# EAGLE design thrust_stand (EAGLE 7.6.0)
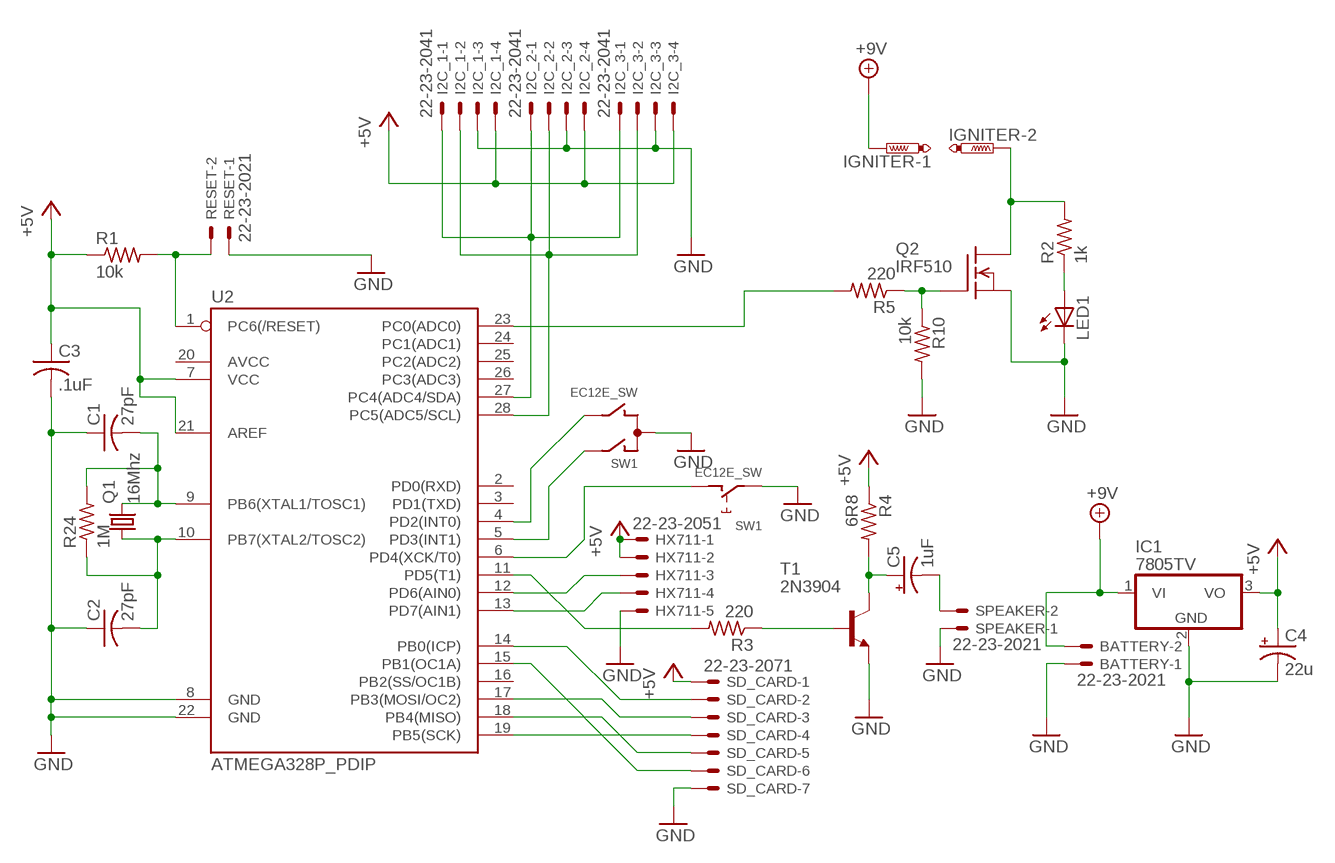
[diagram p0: schematic, sheet 1]

## Parts
BATTERY  22-23-2021  [22-23-2021]
C1  27pF  C-US025-040X050  [C025-040X050]
C2  27pF  C-US025-040X050  [C025-040X050]
C3  .1uF  C-US025-030X050  [C025-030X050]
C4  22u  CPOL-USB45181A  [B45181A]
C5  1uF  CPOL-USB45181A  [B45181A]
HX711  22-23-2051  [22-23-2051]
I2C_1  22-23-2041  [22-23-2041]
I2C_2  22-23-2041  [22-23-2041]
I2C_3  22-23-2041  [22-23-2041]
IC1  7805TV  [TO220V]
IGNITER  PTR2  [P2-38-17]
LED1  LED5MM  [LED5MM]
Q1  16Mhz  CRYSTALHC49S  [HC49/S]
Q2  IRF510  [TO220]
R1  10k  R-US_0207/7  [0207/7]
R2  1k  R-US_0207/7  [0207/7]
R3  220  R-US_0207/7  [0207/7]
R4  6R8  R-US_0207/7  [0207/7]
R5  220  R-US_0309/10  [0309/10]
R10  10k  R-US_0207/7  [0207/7]
R24  1M  R-US_0207/7  [0207/7]
RESET  22-23-2021  [22-23-2021]
SD_CARD  22-23-2071  [22-23-2071]
SPEAKER  22-23-2021  [22-23-2021]
SW1  EC12E_SW  [ALPS_EC12E_SW]
T1  2N3904  [TO92]
U2  ATMEGA328P_PDIP  [DIL28-3]

## Nets
+5V: C3.1 C4.+ HX711.1 HX711.2 I2C_1.4 I2C_2.4 I2C_3.4 IC1.3(VO) R1.1 R4.1 SD_CARD.1 U2.7(VCC) U2.21(AREF)
+9V: BATTERY.2 IC1.1(VI) IGNITER.TP-1
GND: BATTERY.1 C1.1 C2.1 C3.2 C4.- HX711.5 I2C_1.3 I2C_2.3 I2C_3.3 IC1.2(GND) LED1.K(C) Q2.3(S) R10.2 RESET.1 SD_CARD.7 SPEAKER.1 SW1.C SW1.E T1.3(E) U2.8(GND) U2.22(GND)
N$1: I2C_1.2 I2C_2.2 I2C_3.2 U2.28(PC5(ADC5/SCL))
N$2: I2C_1.1 I2C_2.1 I2C_3.1 U2.27(PC4(ADC4/SDA))
N$3: HX711.3 U2.12(PD6(AIN0))
N$4: C1.2 Q1.2 R24.2 U2.9(PB6(XTAL1/TOSC1))
N$5: C2.2 Q1.1 R24.1 U2.10(PB7(XTAL2/TOSC2))
N$6: HX711.4 U2.13(PD7(AIN1))
N$7: SD_CARD.2 U2.14(PB0(ICP))
N$8: SD_CARD.3 U2.17(PB3(MOSI/OC2))
N$9: SD_CARD.4 U2.19(PB5(SCK))
N$10: SD_CARD.5 U2.18(PB4(MISO))
N$11: SD_CARD.6 U2.15(PB1(OC1A))
N$12: Q2.1(G) R5.1 R10.1
N$13: R3.2 U2.11(PD5(T1))
N$14: R3.1 T1.2(B)
N$15: C5.+ R4.2 T1.1(C)
N$16: C5.- SPEAKER.2
N$17: IGNITER.TP-2 Q2.2(D) R2.2
N$18: R5.2 U2.23(PC0(ADC0))
N$19: SW1.B U2.4(PD2(INT0))
N$20: SW1.A U2.5(PD3(INT1))
N$21: LED1.A R2.1
N$22: SW1.D U2.6(PD4(XCK/T0))
N$43: R1.2 RESET.2 U2.1(PC6(/RESET))
Unconnected: SW1.GND1(G) SW1.GND2(G) U2.2(PD0(RXD)) U2.3(PD1(TXD)) U2.16(PB2(SS/OC1B)) U2.20(AVCC) U2.24(PC1(ADC1)) U2.25(PC2(ADC2)) U2.26(PC3(ADC3))

## Library data of the parts
BATTERY RESET SPEAKER = con-molex:22-23-2021: .100" (2.54mm) Center Header - 2 Pin; MF: MOLEX; MPN: 22-23-2021; OC_FARNELL: 1462926; OC_NEWARK: 25C3832
C1-C3 = rcl:C-US: CAPACITOR, American symbol
C4 C5 = rcl:CPOL-US: POLARIZED CAPACITOR, American symbol
HX711 = con-molex:22-23-2051: .100" (2.54mm) Center Header - 5 Pin; MF: MOLEX; MPN: 22-23-2051; OC_FARNELL: 1462952; OC_NEWARK: 38C9178
I2C_1-I2C_3 = con-molex:22-23-2041: .100" (2.54mm) Center Header - 4 Pin; MF: MOLEX; MPN: 22-23-2041; OC_FARNELL: 1462920; OC_NEWARK: 38C0355
IC1 = linear:78*: Positive VOLTAGE REGULATOR Source: http://cache.national.com/ds/LM/LM78L05.pdf http://www.fairchildsemi.com/ds/LM/LM7805.pdf
IGNITER = testpad:PTR2: TEST PIN
LED1 = led:LED: LED OSRAM: - CHIPLED LG R971, LG N971, LY N971, LG Q971, LY Q971, LO R971, LY R971 LH N974, LH R974 LS Q976, LO Q976, LY Q976 LO Q996 - Hyper CHIPLED LW Q18S LB Q993, LB Q99A, LB R99A - SideLED LS A670, LO A670, LY A670, LG A670, LP A670 LB A673, LV A673, LT A673, LW A673 LH A674 LY A675 LS A676, LA A676, LO A676, LY A676, LW A676 LS A679, LY A679, LG A679 - Hyper Micro SIDELED® LS Y876, LA Y876, LO Y876, LY Y876 LT Y87S - SmartLED LW L88C, LW L88S LB L89C, LB L89S, LG L890 LS L89K, LO L89K, LY L89K LS L896, LA L896, LO L896, LY L896 - TOPLED LS T670, LO T670, LY T670, LG T670, LP T670 LSG T670, LSP T670, LSY T670, LOP T670, LYG T670 LG T671, LOG T671, LSG T671 LB T673, LV T673, LT T673, LW T673 LH T674 LS T676, LA T676, LO T676, LY T676, LB T676, LH T676, LSB T676, LW T676 LB T67C, LV T67C, LT T67C, LS T67K, LO T67K, LY T67K, LW E67C LS E67B, LA E67B, LO E67B, LY E67B, LB E67C, LV E67C, LT E67C LW T67C LS T679, LY T679, LG T679 LS T770, LO T770, LY T770, LG T770, LP T770 LB T773, LV T773, LT T773, LW T773 LH T774 LS E675, LA E675, LY E675, LS T675 LS T776, LA T776, LO T776, LY T776, LB T776 LHGB T686 LT T68C, LB T68C - Hyper Mini TOPLED® LB M676 - Mini TOPLED Santana® LG M470 LS M47K, LO M47K, LY M47K Source: http://www.osram.convergy.de LUXEON: - LUMILED® LXK2-PW12-R00, LXK2-PW12-S00, LXK2-PW14-U00, LXK2-PW14-V00 LXK2-PM12-R00, LXK2-PM12-S00, LXK2-PM14-U00 LXK2-PE12-Q00, LXK2-PE12-R00, LXK2-PE12-S00, LXK2-PE14-T00, LXK2-PE14-U00 LXK2-PB12-K00, LXK2-PB12-L00, LXK2-PB12-M00, LXK2-PB14-N00, LXK2-PB14-P00, LXK2-PB14-Q00 LXK2-PR12-L00, LXK2-PR12-M00, LXK2-PR14-Q00, LXK2-PR14-R00 LXK2-PD12-Q00, LXK2-PD12-R00, LXK2-PD12-S00 LXK2-PH12-R00, LXK2-PH12-S00 LXK2-PL12-P00, LXK2-PL12-Q00, LXK2-PL12-R00 Source: www.luxeon.com KINGBRIGHT: KA-3528ASYC Source: www.kingbright.com
Q1 = crystal:CRYSTAL: CRYSTAL; OC_FARNELL: 1667008; OC_NEWARK: unknown
Q2 = transistor-fet:IRF510: N-Channel Enhancement MOSFET (HEXFET); 100V; 5,6A; 0,54Ohm
R1-R5 R10 R24 = rcl:R-US_: RESISTOR, American symbol
SD_CARD = con-molex:22-23-2071: .100" (2.54mm) Center Header - 7 Pin; MF: MOLEX; MPN: 22-23-2071; OC_FARNELL: 1654534; OC_NEWARK: 56H0445
SW1 = switch-alps:EC12E_SW: ALPS rotary Encoder EC12E series with switch; MPN: EC12E2424407; OC_FARNELL: 1520813; OC_NEWARK: 74M1068
T1 = transistor:2N3904: NPN TRANSISTOR
U2 = SparkFun-DigitalIC:ATMEGA328P_PDIP: uC used in the Arduino 32kb flash, 1k EEPROM, 2k SRAM This is the through-hole version of this chip.

## Net classes
1 GND: width 1.016 mm, drill 1.016 mm, clearance 0.508 mm

## Board
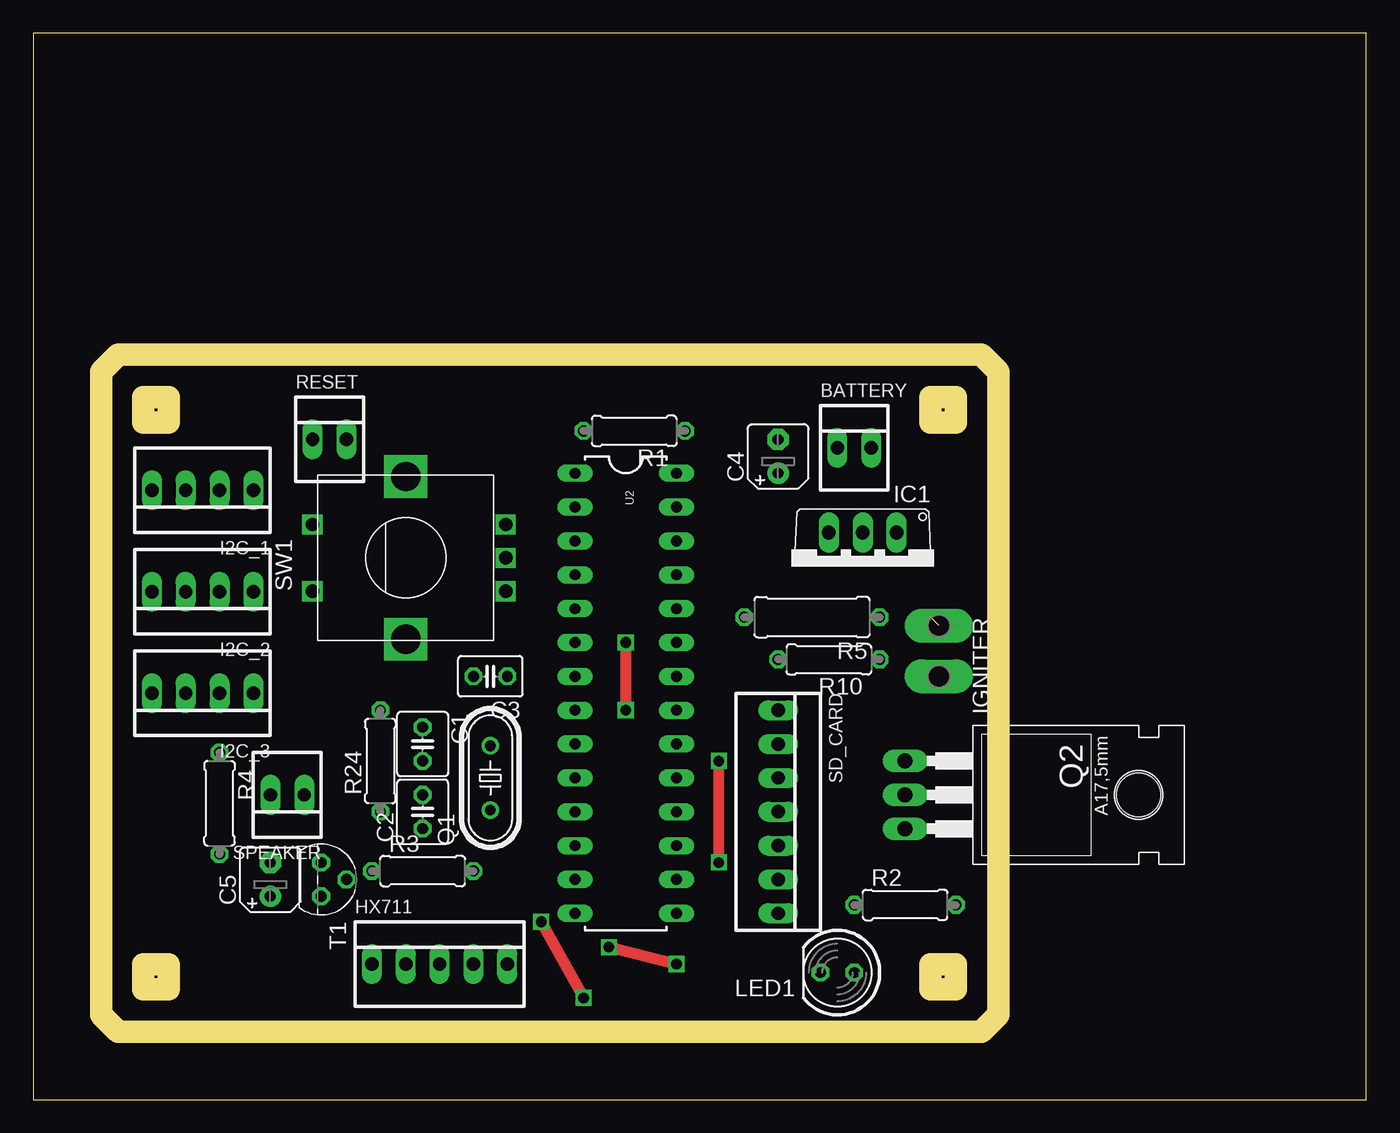
[diagram p1: board, top side]
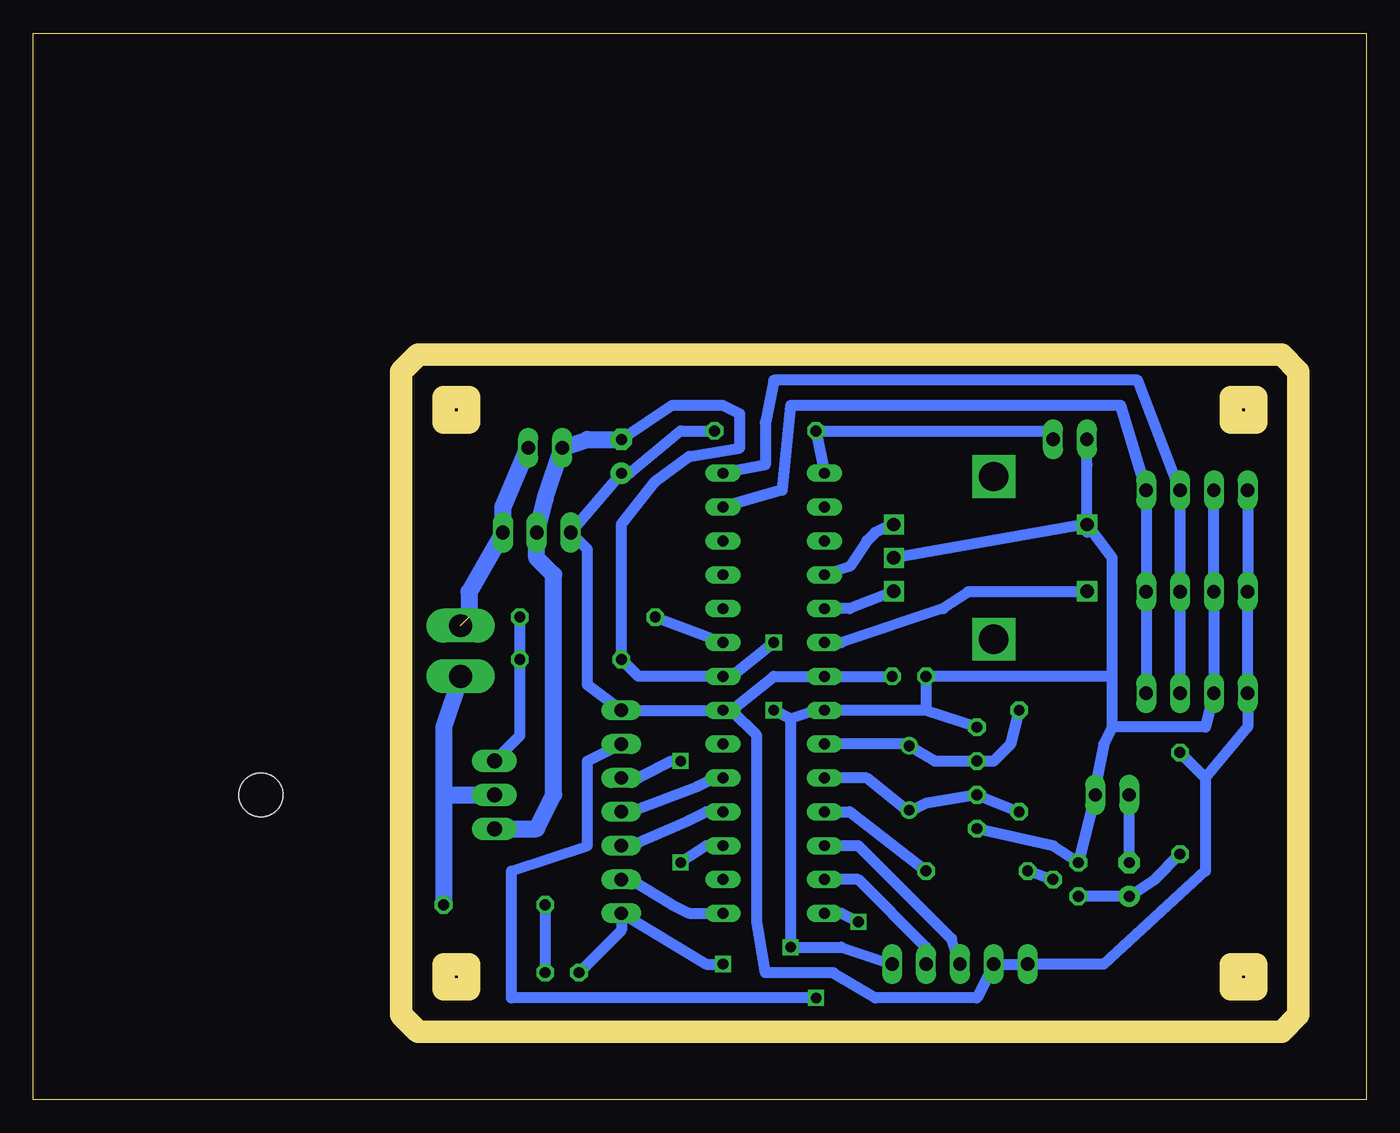
[diagram p2: board, bottom side, seen from below]

Size 100 x 80 mm. Coordinates in mm from the lower left corner, seen from the top.
Outline: 0,0 100,0 100,80 0,80 0,0
Copper layers (1*16): Top 0.035mm / dielectric 1.5mm / Bottom 0.035mm
Design rules "default *": minimum track width 32mil, minimum drill 31mil, track to track 18mil, track to pad 18mil, pad to pad 18mil, via to via 18mil, smd to smd 8mil, copper to edge 0mil, drill to drill 18mil, minimum pad ring 10mil, minimum via ring 8mil, stop-mask expansion 4mil, vias tented up to drill 0mil, thermal gap 10mil
Milling: 24 lines

### Footprints (pad centres in the part's own frame; a part is rotated, then mirrored left to right if it is on the bottom)
22-23-2021 = drill 1 long: 1 -1.27,0; 2 1.27,0
C025-040X050 = drill 0.813 octagon: 1 -1.27,0; 2 1.27,0
C025-030X050 = drill 0.813 octagon: 1 -1.27,0; 2 1.27,0
B45181A = drill 0.813 pad 1.6: + -1.27,0 | drill 0.813 pad 1.6 octagon: - 1.27,0
22-23-2051 = drill 1 long: 1 -5.08,0; 2 -2.54,0; 3 0,0; 4 2.54,0; 5 5.08,0
22-23-2041 = drill 1 long: 1 -3.81,0; 2 -1.27,0; 3 1.27,0; 4 3.81,0
TO220V = drill 1.016 long: 1 -2.54,-2.54; 2 0,-2.54; 3 2.54,-2.54
P2-38-17 = drill 1.702 pad 2.121 long: TP-1 -1.905,0; TP-2 1.905,0
LED5MM = drill 0.813 octagon: A -1.27,0; K 1.27,0
HC49/S = drill 0.813: 1 -2.413,0; 2 2.413,0
TO220 = drill 1.118 long: 1 -2.54,-6.35; 2 0,-6.35; 3 2.54,-6.35 | hole 3.302: 0,11.176
0207/7 = drill 0.813 octagon: 1 -3.81,0; 2 3.81,0
0309/10 = drill 0.813 octagon: 1 -5.08,0; 2 5.08,0
22-23-2071 = drill 1 long: 1 -7.62,0; 2 -5.08,0; 3 -2.54,0; 4 0,0; 5 2.54,0; 6 5.08,0; 7 7.62,0
ALPS_EC12E_SW = drill 1 square: A -2.5,-7.5; B 2.5,-7.5; C 0,-7.5; D -2.5,7; E 2.5,7 | drill 2.2 square: GND1 -6.1,0; GND2 6.1,0
TO92 = drill 0.813 octagon: 1 1.27,0; 2 0,1.905; 3 -1.27,0
DIL28-3 = drill 0.813 long: 1 -16.51,-3.81; 2 -13.97,-3.81; 3 -11.43,-3.81; 4 -8.89,-3.81; 5 -6.35,-3.81; 6 -3.81,-3.81; 7 -1.27,-3.81; 8 1.27,-3.81; 9 3.81,-3.81; 10 6.35,-3.81; 11 8.89,-3.81; 12 11.43,-3.81; 13 13.97,-3.81; 14 16.51,-3.81; 15 16.51,3.81; 16 13.97,3.81; 17 11.43,3.81; 18 8.89,3.81; 19 6.35,3.81; 20 3.81,3.81; 21 1.27,3.81; 22 -1.27,3.81; 23 -3.81,3.81; 24 -6.35,3.81; 25 -8.89,3.81; 26 -11.43,3.81; 27 -13.97,3.81; 28 -16.51,3.81

### Placement (x,y rotation side)
BATTERY  61.59,48.9 0 top
C1  29.21,26.67 270 top
C2  29.21,21.59 90 top
C3  34.29,31.75 180 top
C4  55.88,48.26 90 top
C5  17.78,16.51 90 top
HX711  30.48,10.16 0 top
I2C_1  12.7,45.72 180 top
I2C_2  12.7,38.1 180 top
I2C_3  12.7,30.48 180 top
IC1  62.23,40.01 180 top
IGNITER  67.94,33.66 270 top
LED1  60.33,9.53 180 top
Q1  34.29,24.13 90 top
Q2  71.75,22.86 270 top
R1  45.09,50.16 180 top
R2  65.41,14.61 0 top
R3  29.21,17.14 0 top
R4  13.97,22.23 270 top
R5  58.42,36.2 180 top
R10  59.69,33.02 180 top
R24  26.04,25.4 90 top
RESET  22.23,49.53 0 top
SD_CARD  55.88,21.59 270 top
SPEAKER  19.05,22.86 180 top
SW1  27.94,40.64 90 top
T1  21.59,16.51 270 top
U2  44.45,30.48 270 top

### Tracks (layer width: path | path; a pad name or v marks a point on that pad's centre or on a via)
+5V
  Bottom 0.813: R1.1 51.44,50.16 55.24,46.99 C4.+ IC1.3 58.42,41.27 58.42,31.11 SD_CARD.1 U2.21 47.62,29.21 | C3.1 U2.7 44.45,31.75 47.62,29.21 | I2C_1.4 I2C_2.4 I2C_3.4 8.89,27.94 12.06,24.13 | 12.06,24.13 R4.1 | 12.06,24.13 12.06,17.14 19.68,10.16 HX711.1 HX711.2 29.21,7.62 36.83,7.62 40.01,9.53 45.09,9.53 45.72,13.34 45.72,27.3 47.62,29.21
+9V  (1 unrouted)
  Bottom 1.27: BATTERY.2 64.77,44.45 IC1.1 67.31,38.1 67.31,36.2
GND  (via drill 0.8)
  Top 0.813: v48.26,10.16 v43.18,11.43 | v44.45,29.21 v44.45,34.29
  Bottom 0.813: 20.95,43.18 SW1.C | 20.95,43.18 20.95,42.55 SW1.E 20.94,47.61 RESET.1 | 33.02,29.21 C3.2 19.05,31.75 | 33.02,29.21 C1.1 | 33.02,29.21 U2.8 41.27,29.21 43.18,28.57 | HX711.5 39.37,11.43 v43.18,11.43 43.18,28.57 | C2.1 23.5,19.05 T1.3 SPEAKER.1 20.32,23.5 19.68,26.67 19.05,27.94 | I2C_1.3 I2C_2.3 I2C_3.3 12.06,27.94 19.05,27.94 | 20.95,43.18 19.05,40.64 19.05,31.75 | 19.05,27.94 19.05,31.75 | v48.26,10.16 49.53,10.16 SD_CARD.7 55.88,12.7 LED1.K | 43.18,28.57 v44.45,29.21 | v44.45,34.29 47.62,31.75 U2.22 54.61,31.75 R10.2 55.88,43.18 53.34,46.35 50.8,48.26 46.99,48.9 46.99,51.44 48.26,52.07 52.07,52.07 C4.-
  Bottom 1.27: C4.- 58.42,49.53 BATTERY.1 61.59,45.09 IC1.2 62.23,40.64 60.96,39.37 60.96,22.86 62.23,20.32 Q2.3
N$1
  Bottom 0.813: I2C_3.2 I2C_2.2 I2C_1.2 17.14,53.98 44.45,53.98 45.09,50.8 45.09,47.62 U2.28
N$2
  Bottom 0.813: I2C_3.1 I2C_2.1 I2C_1.1 18.41,52.07 43.18,52.07 43.81,45.72 U2.27
N$3
  Bottom 0.813: U2.12 38.1,19.05 31.11,12.06 HX711.3
N$4
  Bottom 0.813: U2.9 34.29,26.67 Q1.2 32.38,25.4 C1.2 27.94,25.4 26.67,26.67 R24.2
N$5
  Bottom 0.813: 34.29,21.59 33.02,22.23 C2.2 R24.1 | U2.10 37.47,24.13 34.29,21.59 | 34.29,21.59 Q1.1
N$6
  Bottom 0.813: U2.13 38.1,16.51 33.02,11.43 HX711.4
N$7  (via drill 0.8)
  Top 0.813: v38.1,13.34 v41.27,7.62
  Bottom 0.813: U2.14 39.37,13.97 v38.1,13.34 | v41.27,7.62 64.14,7.62 64.14,17.14 58.42,19.05 58.42,25.4 SD_CARD.2
N$8  (via drill 0.8)
  Top 0.813: v51.44,17.78 v51.44,25.4
  Bottom 0.813: U2.17 49.53,19.05 v51.44,17.78 | v51.44,25.4 52.07,25.4 54.61,24.13 SD_CARD.3
N$9
  Bottom 0.813: U2.19 48.9,24.13 50.16,23.5 55.24,21.59 SD_CARD.4
N$10
  Bottom 0.813: U2.18 49.53,21.59 50.8,20.95 55.24,19.05 SD_CARD.5
N$11
  Bottom 0.813: U2.15 50.8,13.97 52.07,14.61 55.24,16.51 SD_CARD.6
N$12
  Bottom 0.813: Q2.1 63.5,27.3 R10.1 R5.1
N$13
  Bottom 0.813: R3.2 38.73,21.59 U2.11
N$14
  Bottom 0.813: R3.1 T1.2
N$15
  Bottom 0.813: T1.1 C5.+ 15.88,16.51 R4.2
N$16
  Bottom 0.813: C5.- SPEAKER.2
N$17
  Bottom 1.27: IGNITER.TP-2 69.22,27.94 69.22,22.86 | 66.04,22.86 Q2.2 69.22,22.86 | 69.22,22.86 R2.2
N$18
  Bottom 0.813: R5.2 U2.23
N$19
  Bottom 0.813: U2.4 38.73,40.01 37.47,41.91 36.83,42.55 35.56,43.18 SW1.B
N$20
  Bottom 0.813: U2.5 38.73,36.83 35.56,38.1 SW1.A
N$21
  Bottom 0.813: R2.1 LED1.A
N$22
  Bottom 0.813: U2.6 39.37,34.29 31.75,36.83 29.84,38.1 20.95,38.1 SW1.D
N$43
  Bottom 0.813: U2.1 R1.2 24.13,50.16 RESET.2